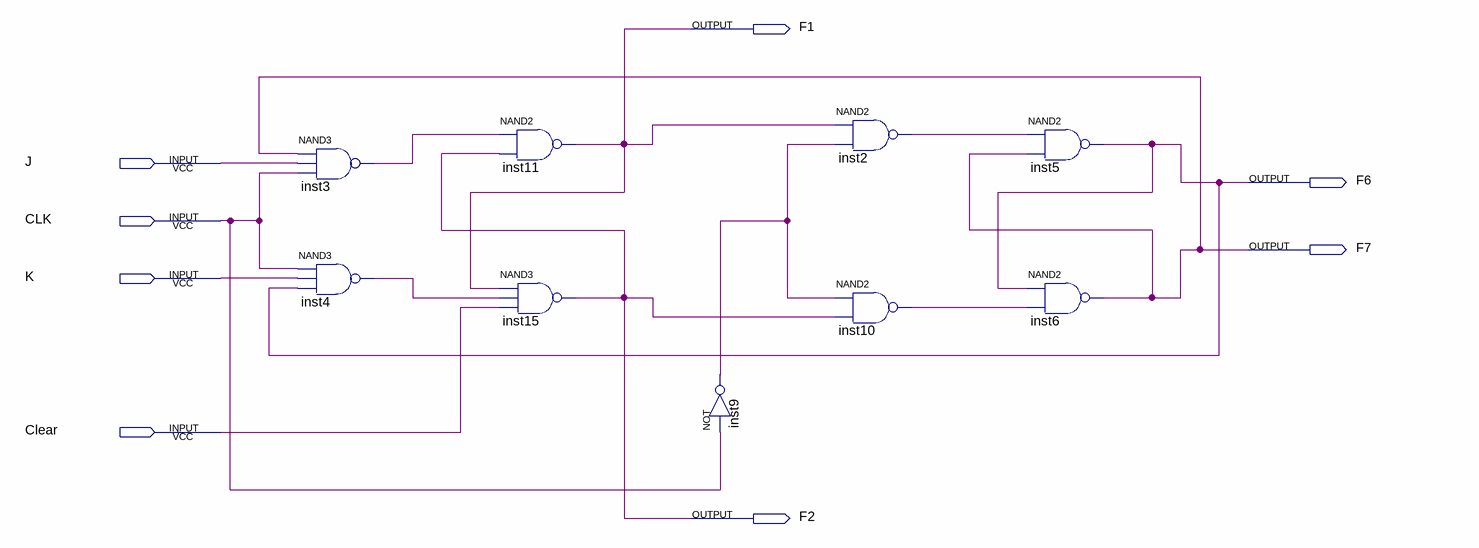
[diagram p0: schematic sheet]
// Quartus schematic MSJK.bdf as structural Verilog: 9 symbols, 8 pins
module MSJK (
  input  J,
  input  CLK,
  input  K,
  input  Clear,
  output F1,
  output F6,
  output F7,
  output F2
);

  wire inst2_out, inst3_out, inst4_out, inst9_out, inst10_out;

  nand inst3 (inst3_out, F7, J, CLK);
  nand inst4 (inst4_out, CLK, K, F6);
  nand inst11 (F1, inst3_out, F2);
  nand inst15 (F2, F1, inst4_out, Clear);
  not inst9 (inst9_out, CLK);
  nand inst2 (inst2_out, F1, inst9_out);
  nand inst10 (inst10_out, inst9_out, F2);
  nand inst5 (F6, inst2_out, F7);
  nand inst6 (F7, F6, inst10_out);
endmodule
